# Altium schematic sheet LCR_1.SchDoc: LCR
size 282 x 203 mm; Origin: Eagle; OriginPath: C:\Users\welly\Downloads\LCR-master\LCR-master\hardware\LCR.sch; OriginSheet: 2; Date: 07/04/2020 14:02:29; SheetNumber: 2; GateName_1: G$1; SymbolName_1: A4L-LOC; LibraryName: frames; DeviceSetName: A4L-LOC; Sheet: Sheet:
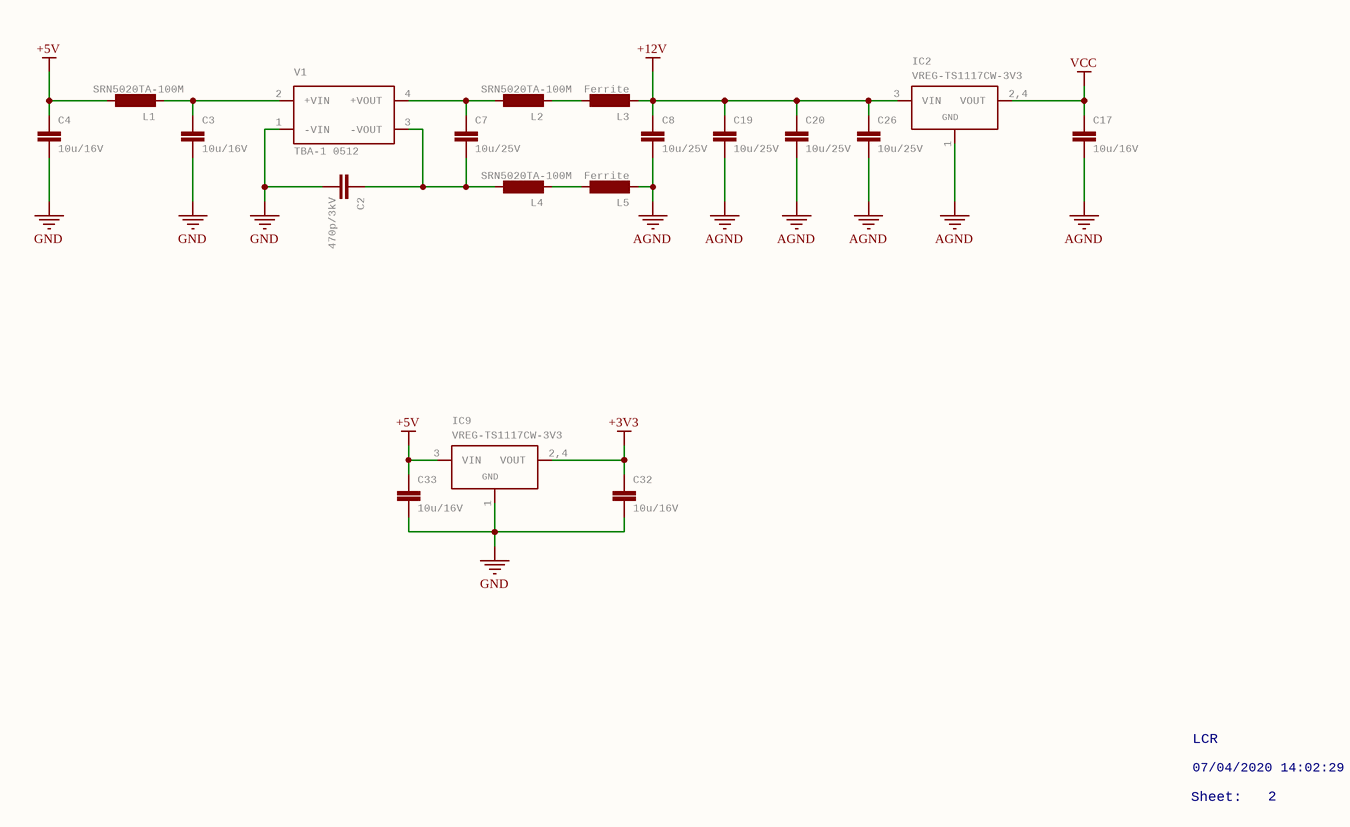
[diagram p0: LCR_1.SchDoc]

## Parts
C2  470p/3kV  [C1812]
C3  10u/16V  [C1206K]
C4  10u/16V  [C1206K]
C7  10u/25V  [C1206K]
C8  10u/25V  [C1206K]
C17  10u/16V  [C1206K]
C19  10u/25V  [C1206K]
C20  10u/25V  [C1206K]
C26  10u/25V  [C1206K]
C32  10u/16V  [C1206K]
C33  10u/16V  [C1206K]
IC2  VREG-TS1117CW-3V3  [SOT223]
IC9  VREG-TS1117CW-3V3  [SOT223]
L1  SRN5020TA-100M  [SRN5040]
L2  SRN5020TA-100M  [SRN5040]
L3  Ferrite  [R0603]
L4  SRN5020TA-100M  [SRN5040]
L5  Ferrite  [R0603]
V1  TBA-1 0512  [TME]

## Nets
+3V3: C32.1 IC9.2,4(VOUT)
+5V: C4.1 C33.1 IC9.3(VIN) L1.P$1
+12V: C8.1 C19.1 C20.1 C26.1 IC2.3(VIN) L3.2
AGND: C8.2 C17.2 C19.2 C20.2 C26.2 IC2.1(GND) L5.2
GND: C2.2 C3.2 C4.2 C32.2 C33.2 IC9.1(GND) V1.1(-VIN)
VCC: C17.1 IC2.2,4(VOUT)
NetC2_1: C2.1 C7.2 L4.P$1 V1.3(-VOUT)
NetC3_1: C3.1 L1.P$2 V1.2(+VIN)
NetC7_1: C7.1 L2.P$1 V1.4(+VOUT)
NetL2_P$2: L2.P$2 L3.1
NetL4_P$2: L4.P$2 L5.1

## Notes on the sheet
- Sheet:
- LCR
- 07/04/2020 14:02:29
- 2

## Library data of the parts
C2 = C-EUC1812: CAPACITOR, European symbol; GateName_1: G$1; SymbolName_1: C-EU-1; DeviceSetName: C-EU; DeviceName: C1812; LibraryName: resistor
C3 C4 C7 C8 C17 C19 C20 C26 C32 C33 = C-EUC1206K: CAPACITOR, European symbol; GateName_1: G$1; SymbolName_1: C-EU; DeviceName: C1206K; LibraryName: rcl; DeviceSetName: C-EU
IC2 IC9 = VREG-TS1117CW-3V3: Voltage Regulators (LDOs, Switching Converters...)  LDOs Taiwan Semi TS1117 800mA max 15V  - compatible On Semi NCP1117 1A max 20V  - compatible Diodes AP2111H 0.6A max 6V (0.25V@0.6A)  - compatible Diodes AP2114H 1A max 6V (0.45V@1A) Taiwan Semi TS9011 250mA max 12V  - compatible Diodes AP2210 300mA max 15V  - compatible Microchip MCP1700 250mA max 6.5V  - compatible Microchip MCP1702 250mA max 13V  - compatible Microchip MCP1703 250mA max 16V  - compatible Microchip MCP1754 150mA max 16V Taiwan Semi TS5204 150mA max 16V (low noise)  DC/DC Converter Modules Recom R-78Ex.x-1.0-W36 1A max 28V  - compatible CUI V78xx-2000  2A max 18V Murata OKI-78SR-x.x/1.5-W36 1.5A max 36V; GateName_1: IC; SymbolName_1: VREG; DeviceName: -TS1117CW-3V3; LibraryName: we-power-mod; DeviceSetName: VREG; GND: GND
L1 L2 L4 = SRN5040: GateName_1: G$1; SymbolName_1: L-EU; LibraryName: custom-ic; DeviceSetName: SRN5040
L3 L5 = INDUCTOR0603: GateName_1: G$1; SymbolName_1: L-EU; DeviceName: 0603; LibraryName: rf; DeviceSetName: INDUCTOR
V1 = TME?*05: DC/DC Converter TME Series 1 Watt    Source: www.tracopower.com .. tme.pdf; MPN: TME 0505S; GateName_1: G$1; SymbolName_1: DC-DC-CONVERTER; DeviceName: 05; DeviceSetName: TME?*; LibraryName: traco-electronic; MF: MF; OC_FARNELL: 1007538; OC_NEWARK: 51R5321